# Altium project PCB_Project_Power.PrjPcb (part 2 of 2)

## Sheet MC9S12C.SchDoc
size B; PageSetup: Record=PageOptions|CenterHorizontal=True|CenterVertical=True|PrintScale=1.06|XCorrection=1.00|YCorrection=1.00|PrintKind=1|BorderSize=5000000|LeftOffset=0|BottomOffset=0|Orientation=2|PaperLength=1000|PaperWidth=1000|Scale=100|PaperSource=7|PrintQuality=-3|MediaType=1|DitherType=10|PrintScaleMode=1|PaperKind=A3|PaperIndex=8
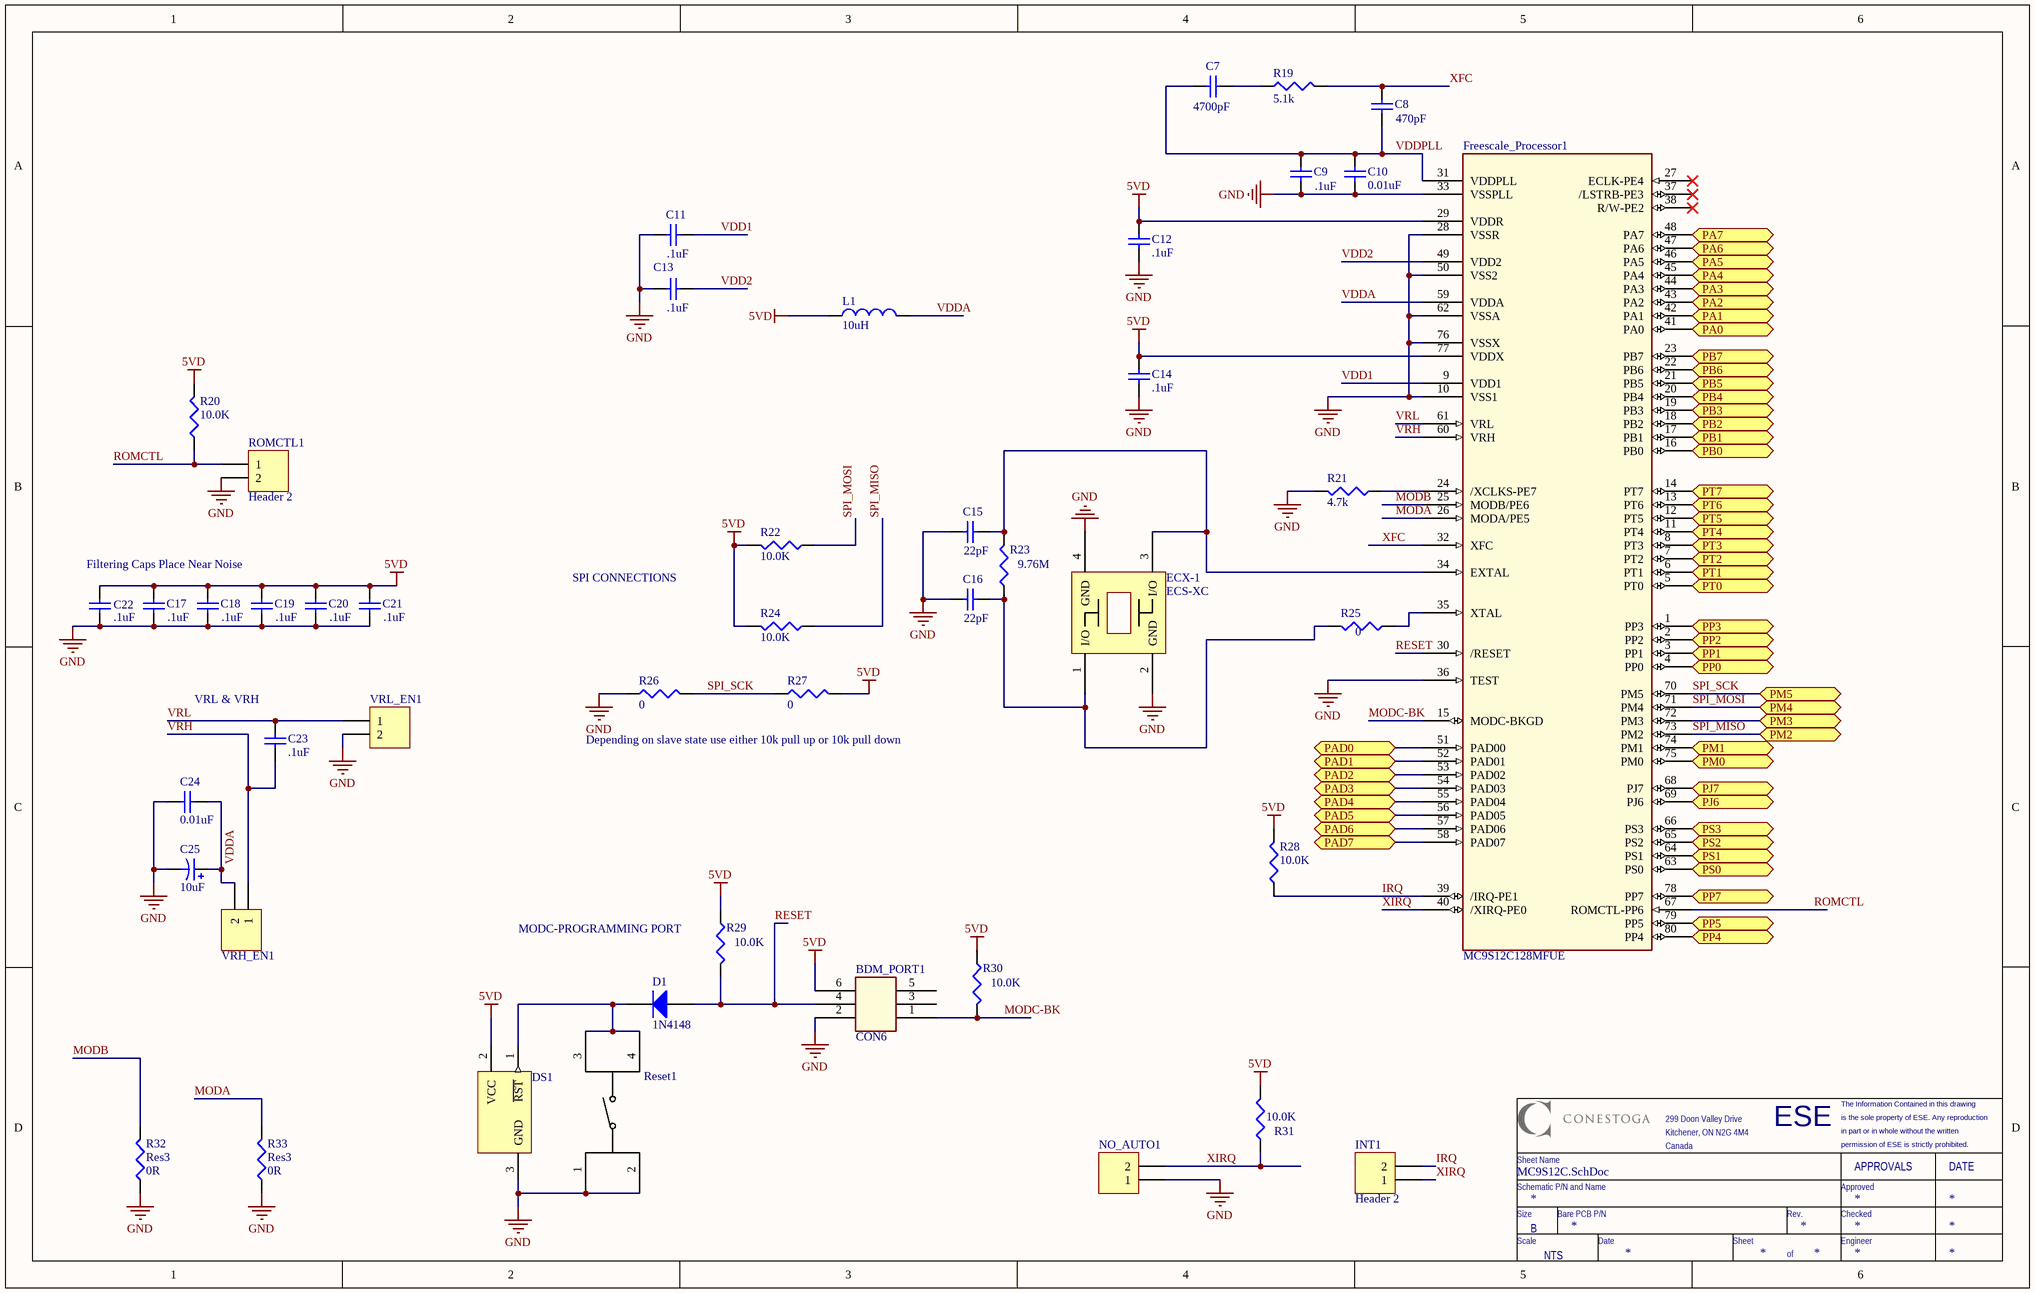
[diagram p11: MC9S12C.SchDoc]

### Parts
BDM_PORT1  CON6  [HDR3X2]
C7  value 4700pF  [CAPC2012X09M]  (hidden comment: p)
C8  value 470pF  [CAPC2012X09M]  (hidden comment: ap)
C9  value .1uF  [CAPC2012X09M]  (hidden comment: p)
C10  value 0.01uF  [C_805]  (hidden comment: Cap)
C11  value .1uF  [CAPC2012X09M]  (hidden comment: Cap)
C12  value .1uF  [C1206]  (hidden comment: Cap)
C13  value .1uF  [CAPC2012X09M]  (hidden comment: Cap)
C14  value .1uF  [C1206]  (hidden comment: Cap)
C15  value 22pF  [CAPC2012X09M]  (hidden comment: Cap)
C16  value 22pF  [CAPC2012X09M]  (hidden comment: Cap)
C17  value .1uF  [CAPC2012X09M]  (hidden comment: Cap)
C18  value .1uF  [CAPC2012X09M]  (hidden comment: Cap)
C19  value .1uF  [CAPC2012X09M]  (hidden comment: Cap)
C20  value .1uF  [CAPC2012X09M]  (hidden comment: Cap)
C21  value .1uF  [CAPC2012X09M]  (hidden comment: Cap)
C22  value .1uF  [CAPC2012X09M]  (hidden comment: Cap)
C23  value .1uF  [CAPC2012X09M]  (hidden comment: Cap)
C24  value 0.01uF  [C_805]  (hidden comment: Cap)
C25  value 10uF  [CAPACITOR_3MM]  (hidden comment: Cap Pol)
D1  1N4148  [zener_sod323]
DS1  DS1813-10  [SOT95P230X110-3M]  (value not drawn)
ECX-1  ECS-XC  [ECX-32]
Freescale_Processor1  MC9S12C128MFUE  [QUAD.65M/80/WG17.45-HCS12]
INT1  Header 2  [HDR1X2]
L1  10uH  [CAPC2012X09M]
NO_AUTO1  Header 2  [HDR1X2]  (value not drawn)
R19  value 5.1k  [RESC2112X05M]  (hidden comment: Res3)
R20  value 10.0K  [RESC2112X05M]  (hidden comment: Res3)
R21  value 4.7k  [RESC2112X05M]  (hidden comment: Res3)
R22  value 10.0K  [RESC2112X05M]  (hidden comment: Res3)
R23  value 9.76M  [RESC2112X05M]  (hidden comment: Res3)
R24  value 10.0K  [RESC2112X05M]  (hidden comment: Res3)
R25  value 0  [RESC2112X05M]  (hidden comment: Res3)
R26  value 0  [RESC2112X05M]  (hidden comment: Res3)
R27  value 0  [RESC2112X05M]  (hidden comment: Res3)
R28  value 10.0K  [RESC2112X05M]  (hidden comment: Res3)
R29  value 10.0K  [RESC2112X05M]  (hidden comment: Res3)
R30  value 10.0K  [RESC2112X05M]  (hidden comment: Res3)
R31  value 10.0K  [RESC2112X05M]  (hidden comment: Res3)
R32  Res3  value 0R  [RESC2112X05M]
R33  Res3  value 0R  [RESC2112X05M]
Reset1  SWITCH_TACTILE  [TACT_SWITCH_6MM_SMT]  (value not drawn)
ROMCTL1  Header 2  [HDR1X2]
VRH_EN1  Header 2  [HDR1X2]  (value not drawn)
VRL_EN1  Header 2  [HDR1X2]  (value not drawn)

### Ports
PA0, PA1, PA2, PA3, PA4, PA5, PA6, PA7, PAD0, PAD1, PAD2, PAD3, PAD4, PAD5, PAD6, PAD7, PB0, PB1, PB2, PB3, PB4, PB5, PB6, PB7, PJ6, PJ7, PM0, PM1, PM2, PM3, PM4, PM5, PP0, PP1, PP2, PP3, PP4, PP5, PP7, PS0, PS1, PS2, PS3, PT0, PT1, PT2, PT3, PT4, PT5, PT6, PT7

### Nets
5VD: BDM_PORT1.6 C12.2 C14.2 C17.2 C18.2 C19.2 C20.2 C21.2 C22.2 DS1.2(VCC) Freescale_Processor1.29(VDDR) Freescale_Processor1.77(VDDX) L1.1 R20.2 R22.2 R24.2 R27.2 R28.2 R29.1 R30.1 R31.2
GND: BDM_PORT1.2 C9.1 C10.1 C11.1 C12.1 C13.1 C14.1 C15.1 C16.1 C17.1 C18.1 C19.1 C20.1 C21.1 C22.1 C24.1 C25.2 DS1.3(GND) ECX-1.2(GND) ECX-1.4(GND) Freescale_Processor1.10(VSS1) Freescale_Processor1.28(VSSR) Freescale_Processor1.33(VSSPLL) Freescale_Processor1.36(TEST) Freescale_Processor1.50(VSS2) Freescale_Processor1.62(VSSA) Freescale_Processor1.76(VSSX) NO_AUTO1.1 R21.2 R26.1 R32.1 R33.1 Reset1.1 Reset1.2 ROMCTL1.2 VRL_EN1.2
AD0: Freescale_Processor1.51(PAD00) ; port PAD0
AD1: Freescale_Processor1.52(PAD01) ; port PAD1
AD2: Freescale_Processor1.53(PAD02) ; port PAD2
AD3: Freescale_Processor1.54(PAD03) ; port PAD3
AD4: Freescale_Processor1.55(PAD04) ; port PAD4
AD5: Freescale_Processor1.56(PAD05) ; port PAD5
AD6: Freescale_Processor1.57(PAD06) ; port PAD6
AD7: Freescale_Processor1.58(PAD07) ; port PAD7
DAC_CS: Freescale_Processor1.1(PP3) ; port PP3
IRQ: Freescale_Processor1.39(/IRQ-PE1) INT1.2 R28.1
MODA: Freescale_Processor1.26(MODA/PE5) R33.2
MODB: Freescale_Processor1.25(MODB/PE6) R32.2
MODC-BK: BDM_PORT1.1 Freescale_Processor1.15(MODC-BKGD) R30.2
PA0: Freescale_Processor1.41(PA0) ; port PA0
PA1: Freescale_Processor1.42(PA1) ; port PA1
PA2: Freescale_Processor1.43(PA2) ; port PA2
PA3: Freescale_Processor1.44(PA3) ; port PA3
PA4: Freescale_Processor1.45(PA4) ; port PA4
PA5: Freescale_Processor1.46(PA5) ; port PA5
PA6: Freescale_Processor1.47(PA6) ; port PA6
PA7: Freescale_Processor1.48(PA7) ; port PA7
PB4: Freescale_Processor1.20(PB4) ; port PB4
PB5: Freescale_Processor1.21(PB5) ; port PB5
PB6: Freescale_Processor1.22(PB6) ; port PB6
PB7: Freescale_Processor1.23(PB7) ; port PB7
PJ6: Freescale_Processor1.69(PJ6) ; port PJ6
PJ7: Freescale_Processor1.68(PJ7) ; port PJ7
RESET: BDM_PORT1.4 D1.A Freescale_Processor1.30(/RESET) R29.2
ROMCTL: Freescale_Processor1.67(ROMCTL-PP6) R20.1 ROMCTL1.1
RX_RS232: Freescale_Processor1.63(PS0) ; port PS0
SPI_MISO: Freescale_Processor1.73(PM2) R24.1 ; port PM2
SPI_MOSI: Freescale_Processor1.71(PM4) R22.1 ; port PM4
SPI_SCK: Freescale_Processor1.70(PM5) R26.2 R27.1 ; port PM5
SPI_SS: Freescale_Processor1.72(PM3) ; port PM3
Switch_Left-: Freescale_Processor1.65(PS2) ; port PS2
Switch_Right-: Freescale_Processor1.66(PS3) ; port PS3
TX_RS232: Freescale_Processor1.64(PS1) ; port PS1
VDD1: C11.2 Freescale_Processor1.9(VDD1)
VDD2: C13.2 Freescale_Processor1.49(VDD2)
VDDA: C24.2 C25.1 Freescale_Processor1.59(VDDA) L1.2 VRH_EN1.2
VDDPLL: C7.1 C8.1 C9.2 C10.2 Freescale_Processor1.31(VDDPLL)
VRH: C23.2 Freescale_Processor1.60(VRH) VRH_EN1.1
VRL: C23.1 Freescale_Processor1.61(VRL) VRL_EN1.1
XFC: C8.2 Freescale_Processor1.32(XFC) R19.2
XIRQ: Freescale_Processor1.40(/XIRQ-PE0) INT1.1 NO_AUTO1.2 R31.1
NetC7_2: C7.2 R19.1
NetC15_2: C15.2 ECX-1.3(I/O) Freescale_Processor1.34(EXTAL) R23.2
NetC16_2: C16.2 ECX-1.1(I/O) R23.1 R25.2
NetCan_Bus1_1: Freescale_Processor1.74(PM1) ; port PM1
NetCan_Bus1_4: Freescale_Processor1.75(PM0) ; port PM0
NetD1_K: D1.K DS1.1(~{RST}) Reset1.3 Reset1.4
NetFreescale_Processor1_2: Freescale_Processor1.2(PP2) ; port PP2
NetFreescale_Processor1_3: Freescale_Processor1.3(PP1) ; port PP1
NetFreescale_Processor1_4: Freescale_Processor1.4(PP0) ; port PP0
NetFreescale_Processor1_5: Freescale_Processor1.5(PT0) ; port PT0
NetFreescale_Processor1_6: Freescale_Processor1.6(PT1) ; port PT1
NetFreescale_Processor1_7: Freescale_Processor1.7(PT2) ; port PT2
NetFreescale_Processor1_8: Freescale_Processor1.8(PT3) ; port PT3
NetFreescale_Processor1_11: Freescale_Processor1.11(PT4) ; port PT4
NetFreescale_Processor1_12: Freescale_Processor1.12(PT5) ; port PT5
NetFreescale_Processor1_13: Freescale_Processor1.13(PT6) ; port PT6
NetFreescale_Processor1_14: Freescale_Processor1.14(PT7) ; port PT7
NetFreescale_Processor1_16: Freescale_Processor1.16(PB0) ; port PB0
NetFreescale_Processor1_17: Freescale_Processor1.17(PB1) ; port PB1
NetFreescale_Processor1_18: Freescale_Processor1.18(PB2) ; port PB2
NetFreescale_Processor1_19: Freescale_Processor1.19(PB3) ; port PB3
NetFreescale_Processor1_24: Freescale_Processor1.24(/XCLKS-PE7) R21.1
NetFreescale_Processor1_35: Freescale_Processor1.35(XTAL) R25.1
NetFreescale_Processor1_78: Freescale_Processor1.78(PP7) ; port PP7
NetFreescale_Processor1_79: Freescale_Processor1.79(PP5) ; port PP5
NetFreescale_Processor1_80: Freescale_Processor1.80(PP4) ; port PP4

Not connected (* = marked no-connect by the designer): BDM_PORT1 3 5; Freescale_Processor1 27(ECLK-PE4)* 37(/LSTRB-PE3)* 38(R/W-PE2)*

### Notes on the sheet
- Filtering Caps Place Near Noise
- SPI CONNECTIONS
- (near C23) VRL & VRH
- Depending on slave state use either 10k pull up or 10k pull down
- MODC-PROGRAMMING PORT
- ESE
- is the sole property of ESE. Any reproduction
- The Information Contained in this drawing
- Schematic P/N and Name
- Sheet Name
- 299 Doon Valley Drive
- Kitchener, ON N2G 4M4
- Canada
- Approved
- in part or in whole without the written
- permission of ESE is strictly prohibited.
- APPROVALS
- DATE
- Size
- Scale
- B
- NTS
- Bare PCB P/N
- Date
- Sheet
- Rev.
- Checked
- Engineer
- of

### Library data of the parts
BDM_PORT1 = CON6: CONN HEADER BRKWAY 6POS DL .100; MPN: 5-146254-3; PN: A105155-ND; URL: http://www.digikey.ca/product-detail/en/5-146254-3/A105155-ND
C7 = CAP-X7R-4700pF-50V-±10%: CAP CER 4700pF 50v X7R 0805; MPN: C0805C472K5RACTU; PN: 399-1155-1-ND; Name: CAP-X7R-4700pF-50V-±10%; URL: http://www.digikey.ca/product-detail/en/C0805C472K5RACTU/399-1155-1-ND
C8 = CAP-X7R-470pF-50V-±10%: CAP CER 470pF 50v X7R 0805; MPN: C0805C471K5RACTU; PN: 399-1142-1-ND; Name: CAP-X7R-470pF-50V-±10%; URL: http://www.digikey.ca/product-detail/en/C0805C471K5RACTU/399-1142-1-ND
C9 C11 C13 C23 = CAP-X7R-.1uF-16V-±10%: CAP CER .1uF 16v X7R 0805; MPN: C0805C104K4RACTU; PN: 399-1167-1-ND; Name: CAP-X7R-.1uF-16V-±10%; URL: http://www.digikey.ca/product-detail/en/C0805C104K4RACTU/399-1167-1-ND
C10 = CAP-Z5U-10000pF-50V-+80%/-20%: CAP CER 10000pF 50v Z5U 0805; MPN: C0805C103Z5UACTU; PN: 399-1173-1-ND; Name: CAP-Z5U-10000pF-50V-+80%/-20%; URL: http://www.digikey.ca/product-detail/en/C0805C103K5RACTU/399-1158-1-ND/411433; DATASheet: http://www.kemet.com/Lists/ProductCatalog/Attachments/53/KEM_C1002_X7R_SMD.pdf
C12 C14 = CAP-X7R-.1uF-16V-±10%: CAP CER .1uF 16v X7R 0805; MPN: C0805C104K4RACTU; PN: 399-3677-1-ND; Name: CAP-X7R-.1uF-16V-±10%; URL: http://www.digikey.ca/product-detail/en/T491A104M035AT/399-3677-1-ND/819002
C15 C16 = CAP-X7R-22pF-630V-±10%: CAP CER 22pF 630v X7R 0805; MPN: C0805C220KBRACTU; PN: 399-5568-1-ND; Name: CAP-X7R-22pF-630V-±10%; URL: http://www.digikey.ca/product-detail/en/C0805C220KBRACTU/399-5568-1-ND
C17-C22 = CAP-X7R-.1uF-50V-±20%: CAP CER .1uF 50v X7R 0805; MPN: C0805C104M5RACTU; PN: 399-1169-1-ND; Name: CAP-X7R-.1uF-50V-±20%; URL: http://www.digikey.ca/product-detail/en/C0805C104M5RACTU/399-1169-1-ND
C24 = CAP-X7R-10000pF-100V-±10%: CAP CER 10000pF 100v X7R 0805; MPN: C0805C103K1RACTU; PN: 399-1159-1-ND; Name: CAP-X7R-10000pF-100V-±10%; URL: http://www.digikey.ca/product-detail/en/GRM155R71E103KA01D/490-1312-1-ND/587934
C25 = Cap Polar-10uF-16V: CAP 85C 10uF ±20% 16V WX Series Aluminum Electrolytic; MPN: UWX1C100MCL2GB; Tan Theta: 0.16; Leakage Current: 3; Rated Ripple Current: 18; PN: 493-2099-1-ND; Name: Cap Polar-10uF-16V; Diameter: 3; URL: http://www.digikey.ca/product-detail/en/UWX1C100MCL2GB/493-2099-1-ND
D1 = Diode 1N4148: High Conductance Fast Diode; MPN: 1N4148WX-TP; PN: 1N4148WXTPMSCT-ND; URL: http://www.digikey.ca/product-detail/en/1N4148WX-TP/1N4148WXTPMSCT-ND
DS1 = DS1813-10: 5V EconoReset with Pushbutton; MPN: DS1813R-10+T&R; PN: DS1813R-10+T&RCT-ND; Published: 13-Oct-2000; LatestRevisionDate: 17-Jul-2002; LatestRevisionNote: Re-released for DXP Platform.; DatasheetVersion: 7-May-1998; PackageVersion: Feb-1999; PackageReference: TO-92; Publisher: Altium Limited; PackageDescription: TO, Flat Index; 3 In-Line, Axial Leads; Body Dia. 4.7mm; Leads 0.56 x 0.51 mm (max); ComponentLink1Description: Manufacturer Link; ComponentLink1URL: http://www.maxim-ic.com/; ComponentLink2Description: Datasheet; ComponentLink2URL: http://pdfserv.maxim-ic.com/en/ds/DS1813.pdf; URL: http://www.digikey.ca/product-detail/en/DS1813R-10%2BT%26R/DS1813R-10%2BT%26RCT-ND
Freescale_Processor1 = MC9S12C128MFUE: IC MCU 16BIT 128KB FLASH 80QFP; MPN: MC9S12C32CFUE25; PN: MC9S12C32CFUE25-ND; URL: http://www.digikey.ca/product-detail/en/MC9S12C32CFUE25/MC9S12C32CFUE25-ND
INT1 = Header 2: Header, 2-Pin Male; MPN: PEC02SFAN; PN: S1212E-02-ND; URL: http://www.digikey.ca/product-detail/en/PEC04SFAN/S1212E-02-ND
L1 = INDUCTOR: URL: http://www.digikey.com/product-detail/en/FBMH2012HM331-T/587-1749-1-ND/1147074
NO_AUTO1 VRH_EN1 VRL_EN1 = Header 2: Header, 2-Pin; MPN: PEC02SFAN; PN: S1212E-02-ND; URL: http://www.digikey.ca/product-detail/en/PEC04SFAN/S1212E-02-ND
R19 = Resistor_4.75K: RES SMD 4.75K OHM 1% 1/8W 0805; MPN: CRCW08054K75FKEA; PN: 541-4.75KCCT-ND; Name: Resistor_4.75K; URL: http://www.digikey.ca/product-detail/en/CRCW08054K75FKEA/541-4.75KCCT-ND
R20 R22 R24 R28-R31 = Resistor_10.0K: RES SMD 10.0K OHM 1% 1/8W 0805; MPN: CRCW080510K0FKEA; PN: 541-1000KCCT-ND; Name: Resistor_10.0K; URL: http://www.digikey.ca/product-detail/en/CRCW080510K0FKEA/541-1000KCCT-ND
R21 R23 R25 = Resistor_9.76M: RES SMD 9.76M OHM 1% 1/8W 0805; MPN: CRCW08059M76FKEA; PN: 541-9760MCCT-ND; Name: Resistor_9.76M; URL: http://www.digikey.ca/product-detail/en/CRCW08059M76FKEA/541-9760MCCT-ND
R26 R27 = Resistor_1.00K: RES SMD 1.00K OHM 1% 1/8W 0805; MPN: CRCW08051K00FKEA; PN: 541-1.00KCCT-ND; Name: Resistor_1.00K; URL: http://www.digikey.ca/product-detail/en/CRCW08051K00FKEA/541-1.00KCCT-ND
R32 R33 = Resistor_0R_Jumper: RES SMD 0 OHM 5% 1/8W 0805; MPN: CRCW08050000Z0EA; PN: 541-0.0ACT-ND; Name: Resistor_0R_Jumper; URL: http://www.digikey.ca/product-detail/en/CRCW08050000Z0EA/541-0.0ACT-ND
Reset1 = SWITCH_TACTILE: SWITCH TACTILE SPST-NO 0.05A 12V; MPN: PTS645SH50SMTR92 LFS; PN: CKN9085CT-ND; URL: http://www.digikey.ca/product-detail/en/PTS645SH50SMTR92%20LFS/CKN9085CT-ND
ROMCTL1 = Header 2: Header, 2-Pin; LatestRevisionDate: 17-Jul-2002; LatestRevisionNote: Re-released for DXP Platform.; Publisher: Altium Limited
ECX-1 = ECS-XC: DATASHEET: http://www.ecsxtal.com/store/pdf/ecx-32.pdf; url: http://www.digikey.ca/product-detail/en/ECS-160-20-33-TR/XC1137CT-ND/813375

## Sheet Encoder.SchDoc
size A
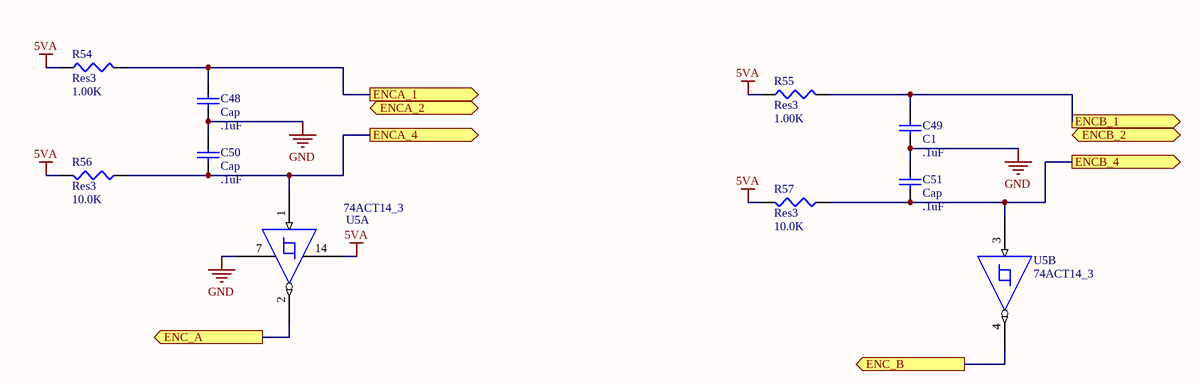
[diagram p12: Encoder.SchDoc]

### Parts
C48  Cap  value .1uF  [CAPC2012X09M]
C49  C1  value .1uF  [CAPC2012X09M]
C50  Cap  value .1uF  [CAPC2012X09M]
C51  Cap  value .1uF  [CAPC2012X09M]
R54  Res3  value 1.00K  [RESC2112X05M]
R55  Res3  value 1.00K  [RESC2112X05M]
R56  Res3  value 10.0K  [RESC2112X05M]
R57  Res3  value 10.0K  [RESC2112X05M]
U5  74ACT14_3  [SOIC127P600X175-14M]  (parts A,B of 6)

### Ports
ENC_A (out), ENC_B (out), ENCA_1 (out), ENCA_2 (out), ENCA_4 (out), ENCB_1 (out), ENCB_2 (out), ENCB_4 (out)

### Nets
5VA: R54.1 R55.1 R56.2 R57.2 U5.14(VCC)
GND: C48.1 C49.1 C50.2 C51.2 U5.7(GND_POWER)
NetC48_2: C48.2 R54.2 ; port ENCA_1
NetC49_2: C49.2 R55.2 ; port ENCB_1
NetC50_1: C50.1 R56.1 U5.1(A) ; port ENCA_4
NetC51_1: C51.1 R57.1 U5.3(A) ; port ENCB_4
NetFreescale_Processor1_5: U5.2(Y) ; port ENC_A
NetFreescale_Processor1_6: U5.4(Y) ; port ENC_B

### Library data of the parts
C48-C51 = CAP-X7R-.1uF-16V-±10%: as C9 on sheet MC9S12C; Name: CAP-X7R-.1uF-16V-±10%; URL: http://www.digikey.ca/product-detail/en/C0805C104K4RACTU/399-1167-1-ND
R54 R55 = Resistor_1.00K: as R26 on sheet MC9S12C; Name: Resistor_1.00K; URL: http://www.digikey.ca/product-detail/en/CRCW08051K00FKEA/541-1.00KCCT-ND
R56 R57 = Resistor_10.0K: RES SMD 10.0K OHM 1% 1/8W 0805; MPN: CRCW080510K0FKEA; PN: 541-10.0KCCT-ND; Name: Resistor_10.0K; URL: http://www.digikey.ca/product-detail/en/CRCW080510K0FKEA/541-10.0KCCT-ND
U5 = 74ACT14_3: IC INVERTER HEX SCHMITT 14SOIC; MPN: 74ACT14SCX; PN: 74ACT14SCXCT-ND; URL: http://www.digikey.ca/product-detail/en/74ACT14SCX/74ACT14SCXCT-ND

## Sheet SPI_Expander_MCP23S09.SchDoc
size A
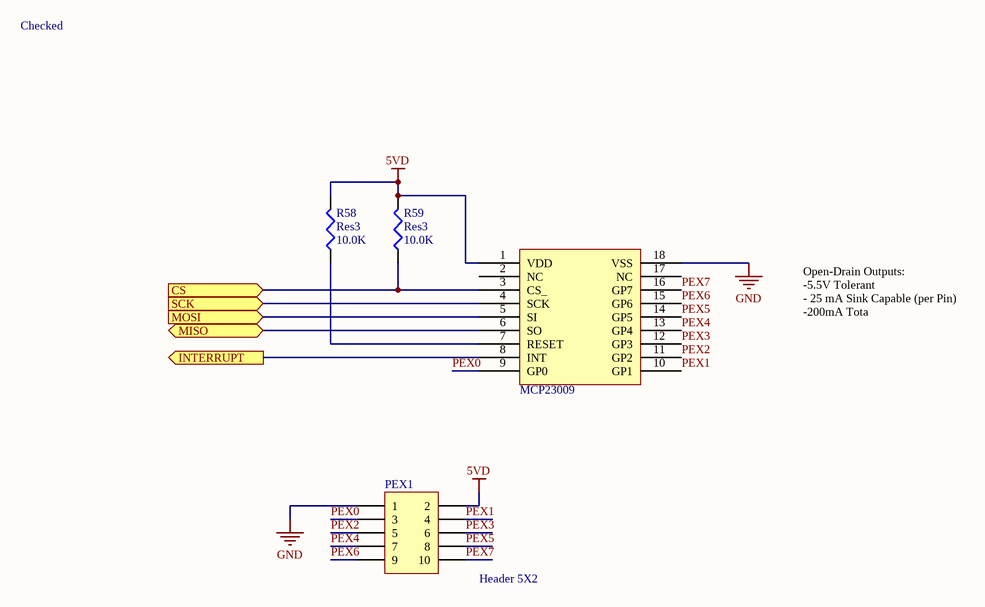
[diagram p13: SPI_Expander_MCP23S09.SchDoc]

### Parts
IC1  MCP23009  [MCP23009]
PEX1  Header 5X2  [HDR2X5]
R58  Res3  value 10.0K  [RESC2112X05M]
R59  Res3  value 10.0K  [RESC2112X05M]

### Ports
CS (in), INTERRUPT (out), MISO, MOSI (in), SCK (in)

### Nets
5VD: IC1.1(VDD) PEX1.2 R58.2 R59.2
GND: IC1.18(VSS) PEX1.1
PEX0: IC1.9(GP0) PEX1.3
PEX1: IC1.10(GP1) PEX1.4
PEX2: IC1.11(GP2) PEX1.5
PEX3: IC1.12(GP3) PEX1.6
PEX4: IC1.13(GP4) PEX1.7
PEX5: IC1.14(GP5) PEX1.8
PEX6: IC1.15(GP6) PEX1.9
PEX7: IC1.16(GP7) PEX1.10
PJ6: IC1.3(CS_) R59.1 ; port CS
PJ7: IC1.8(INT) ; port INTERRUPT
SPI_MISO: IC1.6(SO) ; port MISO
SPI_MOSI: IC1.5(SI) ; port MOSI
SPI_SCK: IC1.4(SCK) ; port SCK
NetIC1_7: IC1.7(RESET) R58.1

Not connected (* = marked no-connect by the designer): IC1 2(NC) 17(NC)

### Notes on the sheet
- Checked
- Open-Drain Outputs:
  -5.5V Tolerant
  - 25 mA Sink Capable (per Pin)
  -200mA Tota

### Library data of the parts
PEX1 = Header 5X2: Header, 5-Pin, Dual row; LatestRevisionDate: 17-Jul-2002; LatestRevisionNote: Re-released for DXP Platform.; Publisher: Altium Limited
R58 R59 = Resistor_10.0K: as R56 on sheet Encoder; Name: Resistor_10.0K; URL: http://www.digikey.ca/product-detail/en/CRCW080510K0FKEA/541-10.0KCCT-ND
IC1 = MCP23009: URL: http://www.digikey.ca/product-detail/en/MCP23S09-E%2FSO/MCP23S09-E%2FSO-ND/2021356; DATASHEET: http://www.microchip.com/mymicrochip/filehandler.aspx?ddocname=en538928

## Sheet PSU.SchDoc
size A
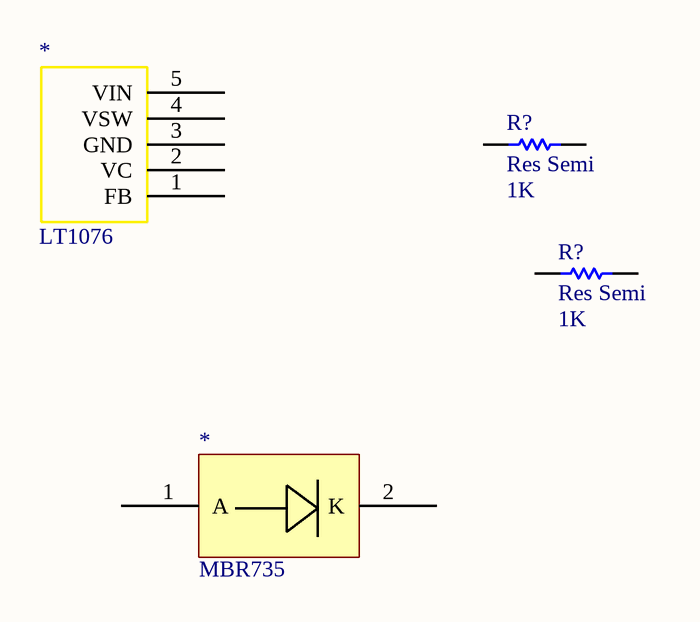
[diagram p14: PSU.SchDoc]

### Parts
(Parts that share a designator on the sheet are numbered #1, #2 ... from top to bottom, then left to right.)
*#1  LT1076  [LT1076]
*#2  MBR735  [MBR735]
R?#1  Res Semi  value 1K  [AXIAL-0.5]
R?#2  Res Semi  value 1K  [AXIAL-0.5]

### Nets

Not connected (* = marked no-connect by the designer): *#1 1(FB) 2(VC) 3(GND) 4(VSW) 5(VIN); *#2 1(A) 2(K); R?#1 1 2; R?#2 1 2

### Library data of the parts
R?#1 R?#2 = Res Semi: Semiconductor Resistor; Published: 8-Jun-2000; LatestRevisionDate: 17-Jul-2002; LatestRevisionNote: Re-released for DXP Platform.; PackageReference: AXIAL-0.5; Publisher: Altium Limited; PackageDescription: Axial Device, Thru-Hole; 2 Leads; 0.5 in Pin Spacing

## Nets that join several sheets
3.3VD: Project_Board (C33.2 V1.2), LM1117_3.3V_Reg (C42.1 U4.2 U4.4), Accelerometer_3Axis-bak (5 pins), ili9327 (AR_PW1.2)
5VA: Project_Board (5 pins), A (C47_A.2 L2_A.2 R52_A.2), L293DD (C34.2 SM_H1.20), RC_Servo_ (RC_T1.3 RC_T2.3), ili9327 (AR_PW1.1), Encoder (5 pins)
5VD: Project_Board (C32.2 SPI1.2 VA1.2), RS232 (C26.1 MAX2.16 R34.1 R39.2), D (C47_D.2 L2_D.2 R52_D.2), LM1117_3.3V_Reg (C43.1 U4.3), Can_Bus_Tranciever (Can_Bus1.3 P1.2 R13.2 R14.2), Accelerometer_3Axis-bak (C4.2 U2.4), DAC_8Bit (MAX1.6 R18.2), ili9327 (AR_DIG1.1 AR_PW1.3), MC9S12C (21 pins), SPI_Expander_MCP23S09 (IC1.1 PEX1.2 R58.2 R59.2)
GND: Project_Board (22 pins), RS232 (8 pins), A (8 pins), D (8 pins), LM1117_3.3V_Reg (C42.2 C43.2 U4.1), Can_Bus_Tranciever (C5.1 C6.1 Can_Bus1.2 R15.1), L6225_MotorDriver_ (10 pins), L293DD (15 pins), RC_Servo_ (R49.1 R50.1), Accelerometer_3Axis-bak (14 pins), DAC_8Bit (MAX1.7), ili9327 (AR_DIG1.2 AR_PW1.4 AR_PW1.5 AR_PW1.6), MC9S12C (36 pins), Encoder (5 pins), SPI_Expander_MCP23S09 (IC1.18 PEX1.1)
VIN: Project_Board (*3.1 VIN_IN1.2), A (C44_A.1 C45_A.1 SMPS-A1_A.7), D (C44_D.1 C45_D.1 SMPS-A1_D.7), L6225_MotorDriver_ (6 pins), L293DD (C35.1 SM_H1.10)
AD0: ili9327 (AR_AD1.1), MC9S12C (Freescale_Processor1.51)
AD1: ili9327 (AR_AD1.2), MC9S12C (Freescale_Processor1.52)
AD2: ili9327 (AR_AD1.3), MC9S12C (Freescale_Processor1.53)
AD3: ili9327 (AR_AD1.4), MC9S12C (Freescale_Processor1.54)
AD4: Project_Board (ANALOG1.5), ili9327 (AR_AD1.5), MC9S12C (Freescale_Processor1.55)
AD5: Project_Board (ANALOG1.4), Accelerometer_3Axis-bak (R9.1 U2.7), ili9327 (AR_AD1.6), MC9S12C (Freescale_Processor1.56)
AD6: Project_Board (ANALOG1.3), MC9S12C (Freescale_Processor1.57)
AD7: Project_Board (ANALOG1.2), MC9S12C (Freescale_Processor1.58)
DAC_CS: DAC_8Bit (MAX1.1 R18.1), MC9S12C (Freescale_Processor1.1)
NetACC1_2: Project_Board (ACC1.2), Accelerometer_3Axis-bak (C3.1 U1.9)
NetACC1_3: Project_Board (ACC1.3), Accelerometer_3Axis-bak (C2.1 U1.8)
NetACC1_4: Project_Board (ACC1.4), Accelerometer_3Axis-bak (C1.1 U1.7)
NetACC1_5: Project_Board (ACC1.5), Accelerometer_3Axis-bak (R7.1)
NetC48_2: Project_Board (ENC_L1.1), Encoder (C48.2 R54.2)
NetC49_2: Project_Board (ENC_R1.1), Encoder (C49.2 R55.2)
NetC50_1: Project_Board (ENC_L1.4), Encoder (C50.1 R56.1 U5.1)
NetC51_1: Project_Board (ENC_R1.4), Encoder (C51.1 R57.1 U5.3)
NetCAN1_1: Project_Board (CAN1.1), Can_Bus_Tranciever (Can_Bus1.6 R16.2)
NetCAN1_2: Project_Board (CAN1.2), Can_Bus_Tranciever (Can_Bus1.7 R17.2)
NetCAN1_3: Project_Board (CAN1.3), Can_Bus_Tranciever (Can_Bus1.5)
NetCan_Bus1_1: Can_Bus_Tranciever (Can_Bus1.1 R14.1), MC9S12C (Freescale_Processor1.74)
NetCan_Bus1_4: Can_Bus_Tranciever (Can_Bus1.4 R13.1), MC9S12C (Freescale_Processor1.75)
NetCTS_RTS1_1: Project_Board (CTS_RTS1.1), RS232 (MAX2.10)
NetCTS_RTS1_2: Project_Board (CTS_RTS1.2), RS232 (MAX2.9 R38.2)
NetDAC1_1: Project_Board (DAC1.1), DAC_8Bit (MAX1.4)
NetDAC1_2: Project_Board (DAC1.2), DAC_8Bit (MAX1.5)
NetDAC1_3: Project_Board (DAC1.3), DAC_8Bit (MAX1.8)
NetDCL1_1: Project_Board (DCL1.1), L6225_MotorDriver_ (U?.3)
NetDCL1_2: Project_Board (DCL1.2), L6225_MotorDriver_ (U?.18)
NetDCR1_1: Project_Board (DCR1.1), L6225_MotorDriver_ (U?.9)
NetDCR1_2: Project_Board (DCR1.2), L6225_MotorDriver_ (U?.12)
NetFreescale_Processor1_2: Accelerometer_3Axis-bak (R4.1), MC9S12C (Freescale_Processor1.2)
NetFreescale_Processor1_3: Accelerometer_3Axis-bak (R5.1), MC9S12C (Freescale_Processor1.3)
NetFreescale_Processor1_4: Accelerometer_3Axis-bak (R3.1), MC9S12C (Freescale_Processor1.4)
NetFreescale_Processor1_5: MC9S12C (Freescale_Processor1.5), Encoder (U5.2)
NetFreescale_Processor1_6: MC9S12C (Freescale_Processor1.6), Encoder (U5.4)
NetFreescale_Processor1_7: RC_Servo_ (RC_R1.1), MC9S12C (Freescale_Processor1.7)
NetFreescale_Processor1_8: RC_Servo_ (RC_R2.1), MC9S12C (Freescale_Processor1.8)
NetFreescale_Processor1_11: L293DD (R42.2 SM_H1.2), MC9S12C (Freescale_Processor1.11)
NetFreescale_Processor1_12: L293DD (R44.2 SM_H1.9), MC9S12C (Freescale_Processor1.12)
NetFreescale_Processor1_13: L293DD (R43.2 SM_H1.12), MC9S12C (Freescale_Processor1.13)
NetFreescale_Processor1_14: L293DD (R45.2 SM_H1.19), MC9S12C (Freescale_Processor1.14)
NetFreescale_Processor1_16: L6225_MotorDriver_ (U?.6), MC9S12C (Freescale_Processor1.16)
NetFreescale_Processor1_17: L6225_MotorDriver_ (U?.14), MC9S12C (Freescale_Processor1.17)
NetFreescale_Processor1_18: L6225_MotorDriver_ (U?.7), MC9S12C (Freescale_Processor1.18)
NetFreescale_Processor1_19: L6225_MotorDriver_ (U?.15), MC9S12C (Freescale_Processor1.19)
NetFreescale_Processor1_78: L293DD (R46.1 SM_H1.1 SM_H1.11), MC9S12C (Freescale_Processor1.78)
NetFreescale_Processor1_79: L6225_MotorDriver_ (R48.2), MC9S12C (Freescale_Processor1.79)
NetFreescale_Processor1_80: L6225_MotorDriver_ (R47.2), MC9S12C (Freescale_Processor1.80)
NetR50_2: Project_Board (ServoMotor1.2), RC_Servo_ (R50.2 RC_T2.2)
PA0: Project_Board (PA1.1), ili9327 (AR_DIG1.8), MC9S12C (Freescale_Processor1.41)
PA1: Project_Board (PA1.2), ili9327 (AR_DIG1.7), MC9S12C (Freescale_Processor1.42)
PA2: Project_Board (PA1.3), ili9327 (AR_DIG2.6), MC9S12C (Freescale_Processor1.43)
PA3: Project_Board (PA1.4), ili9327 (AR_DIG2.5), MC9S12C (Freescale_Processor1.44)
PA4: Project_Board (PA1.5), ili9327 (AR_DIG2.4), MC9S12C (Freescale_Processor1.45)
PA5: Project_Board (PA1.6), ili9327 (AR_DIG2.3), MC9S12C (Freescale_Processor1.46)
PA6: Project_Board (PA1.7), ili9327 (AR_DIG2.2), MC9S12C (Freescale_Processor1.47)
PA7: Project_Board (PA1.8), ili9327 (AR_DIG2.1), MC9S12C (Freescale_Processor1.48)
PB4: Project_Board (PBHB1.4), MC9S12C (Freescale_Processor1.20)
PB5: Project_Board (PBHB1.3), MC9S12C (Freescale_Processor1.21)
PB6: Project_Board (PBHB1.2), ili9327 (AR_DIG2.8), MC9S12C (Freescale_Processor1.22)
PB7: Project_Board (PBHB1.1), ili9327 (AR_DIG2.7), MC9S12C (Freescale_Processor1.23)
PJ6: MC9S12C (Freescale_Processor1.69), SPI_Expander_MCP23S09 (IC1.3 R59.1)
PJ7: MC9S12C (Freescale_Processor1.68), SPI_Expander_MCP23S09 (IC1.8)
RX_RS232: RS232 (MAX2.12 R37.2), MC9S12C (Freescale_Processor1.63)
Servo Signal: Project_Board (CameraCon1.4 ServoMotor1.1), RC_Servo_ (R49.2 RC_T1.2)
SPI_MISO: Project_Board (SPI1.1), ili9327 (AR_DIG1.5), MC9S12C (Freescale_Processor1.73 R24.1), SPI_Expander_MCP23S09 (IC1.6)
SPI_MOSI: Project_Board (SPI1.4), DAC_8Bit (MAX1.3), ili9327 (AR_DIG1.4), MC9S12C (Freescale_Processor1.71 R22.1), SPI_Expander_MCP23S09 (IC1.5)
SPI_SCK: Project_Board (SPI1.3), DAC_8Bit (MAX1.2), ili9327 (AR_DIG1.3), MC9S12C (Freescale_Processor1.70 R26.2 R27.1), SPI_Expander_MCP23S09 (IC1.4)
SPI_SS: Project_Board (SPI1.5), ili9327 (AR_DIG1.6), MC9S12C (Freescale_Processor1.72)
Stepper A: Project_Board (CameraCon1.13), L293DD (SM_H1.3)
Stepper A Bar: Project_Board (CameraCon1.12), L293DD (SM_H1.8)
Stepper B: Project_Board (CameraCon1.9), L293DD (SM_H1.13)
Stepper B Bar: Project_Board (CameraCon1.8), L293DD (SM_H1.18)
Switch_Left-: Project_Board (CameraCon1.15 R41.2), MC9S12C (Freescale_Processor1.65)
Switch_Right-: Project_Board (CameraCon1.1 R40.2), MC9S12C (Freescale_Processor1.66)
TX_RS232: RS232 (MAX2.11 R35.1), MC9S12C (Freescale_Processor1.64)